# EAGLE schematic AutoPBT (EAGLE 9.7.0)
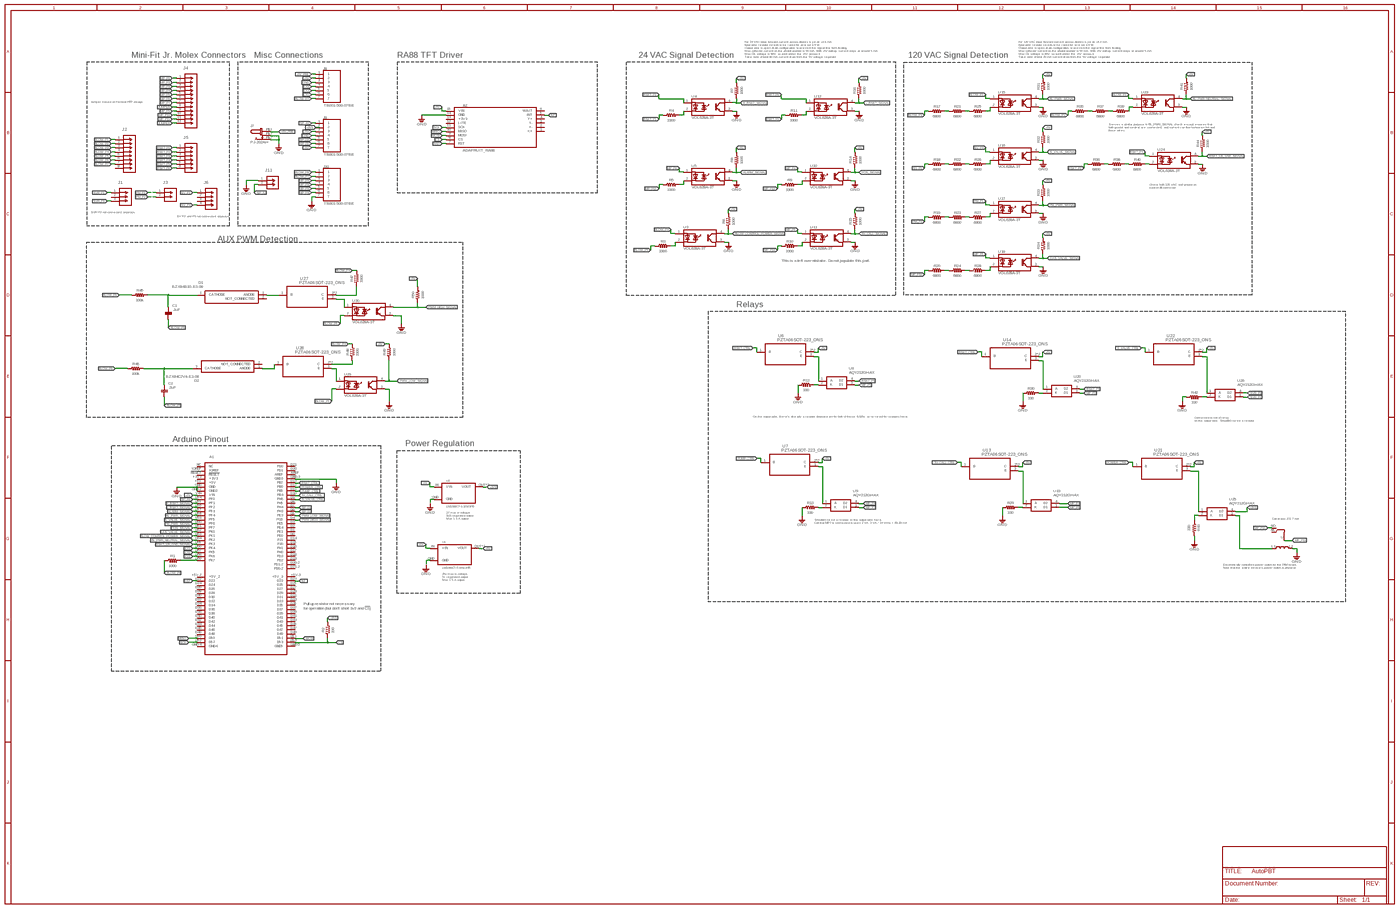
[diagram p0: schematic, sheet 1, overview]
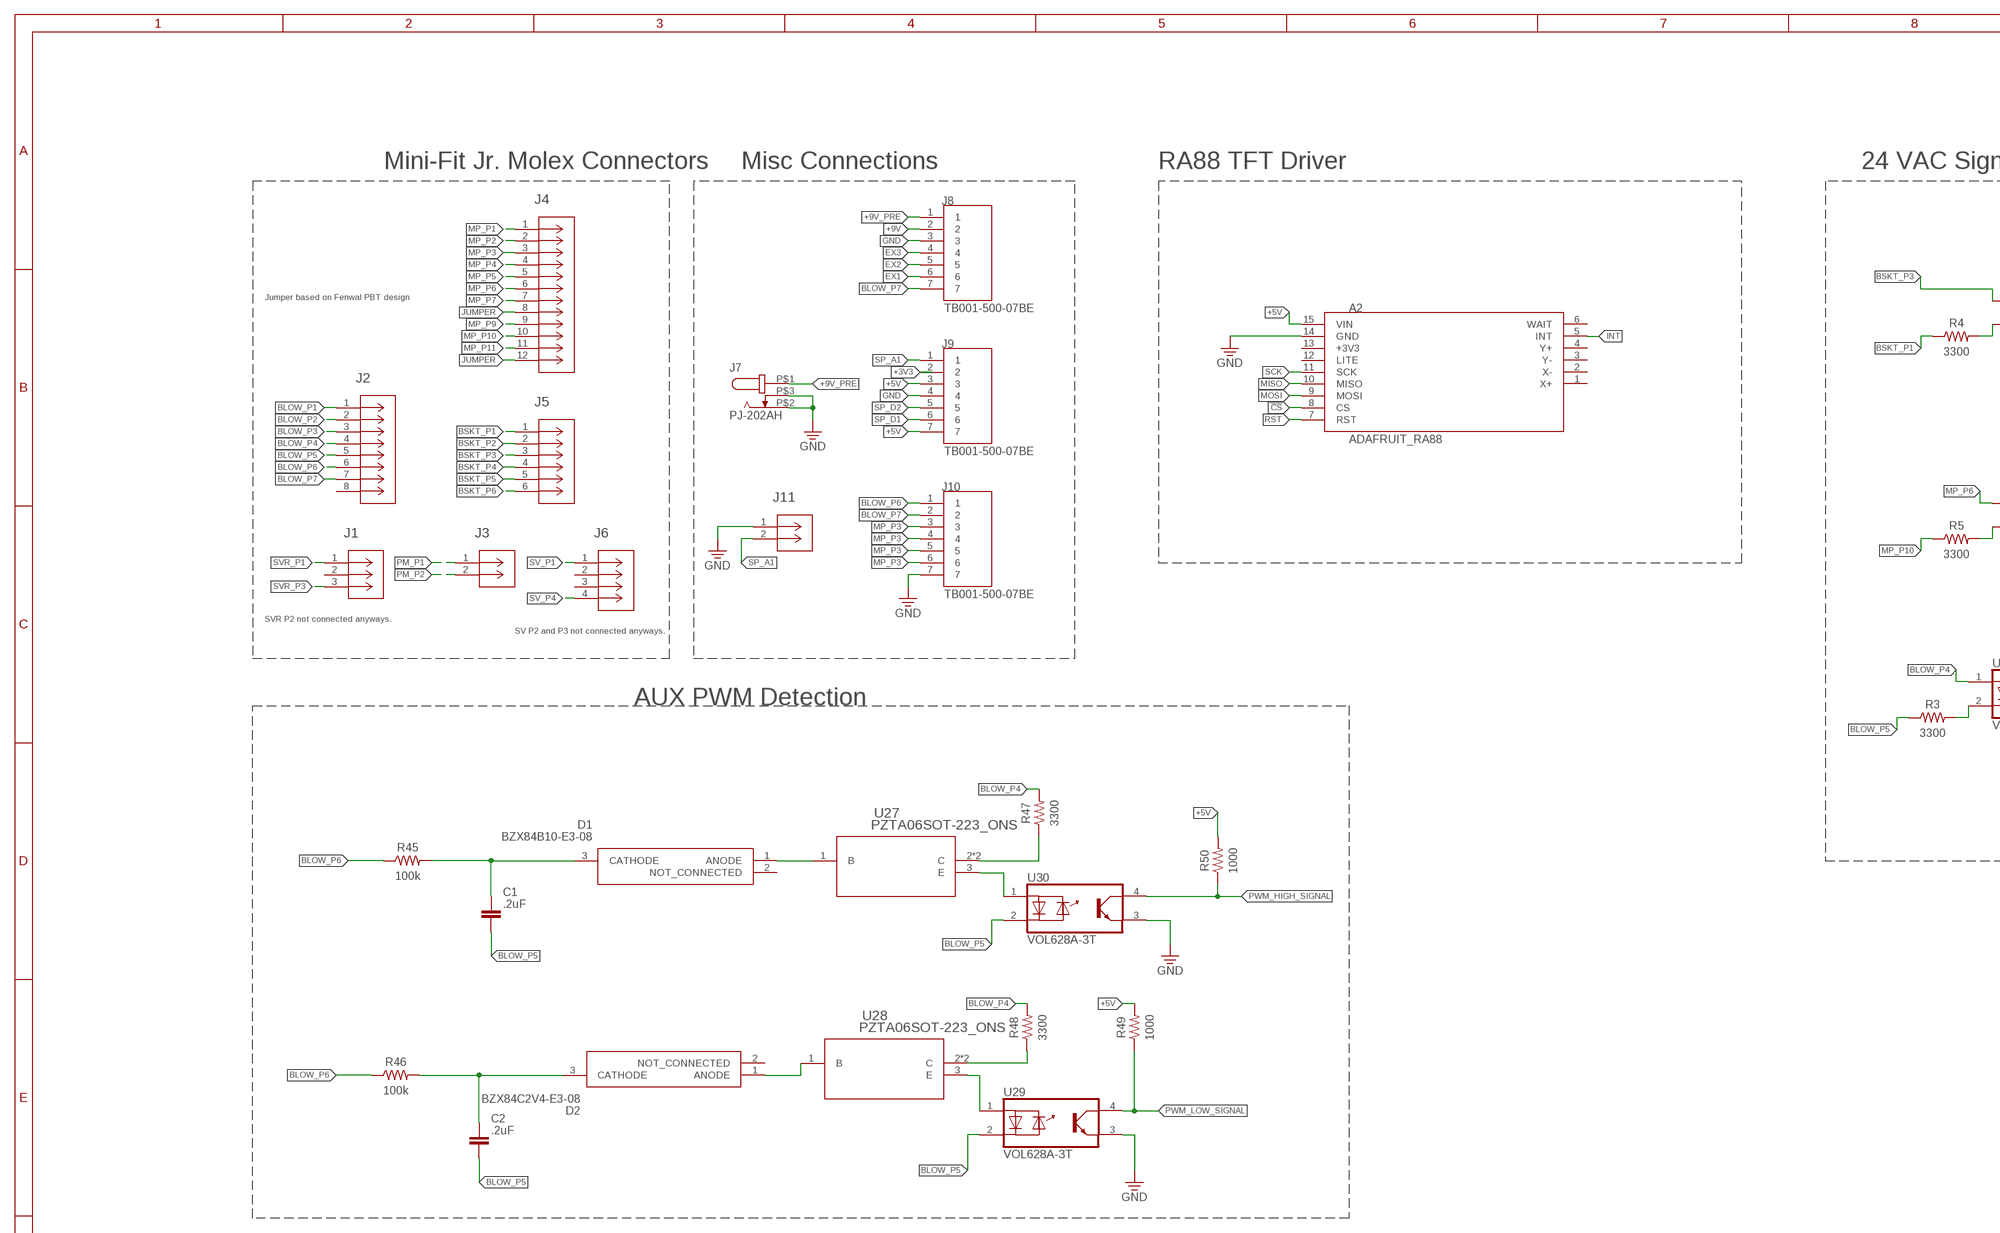
[diagram p1: schematic, sheet 1, part 1 of 4]
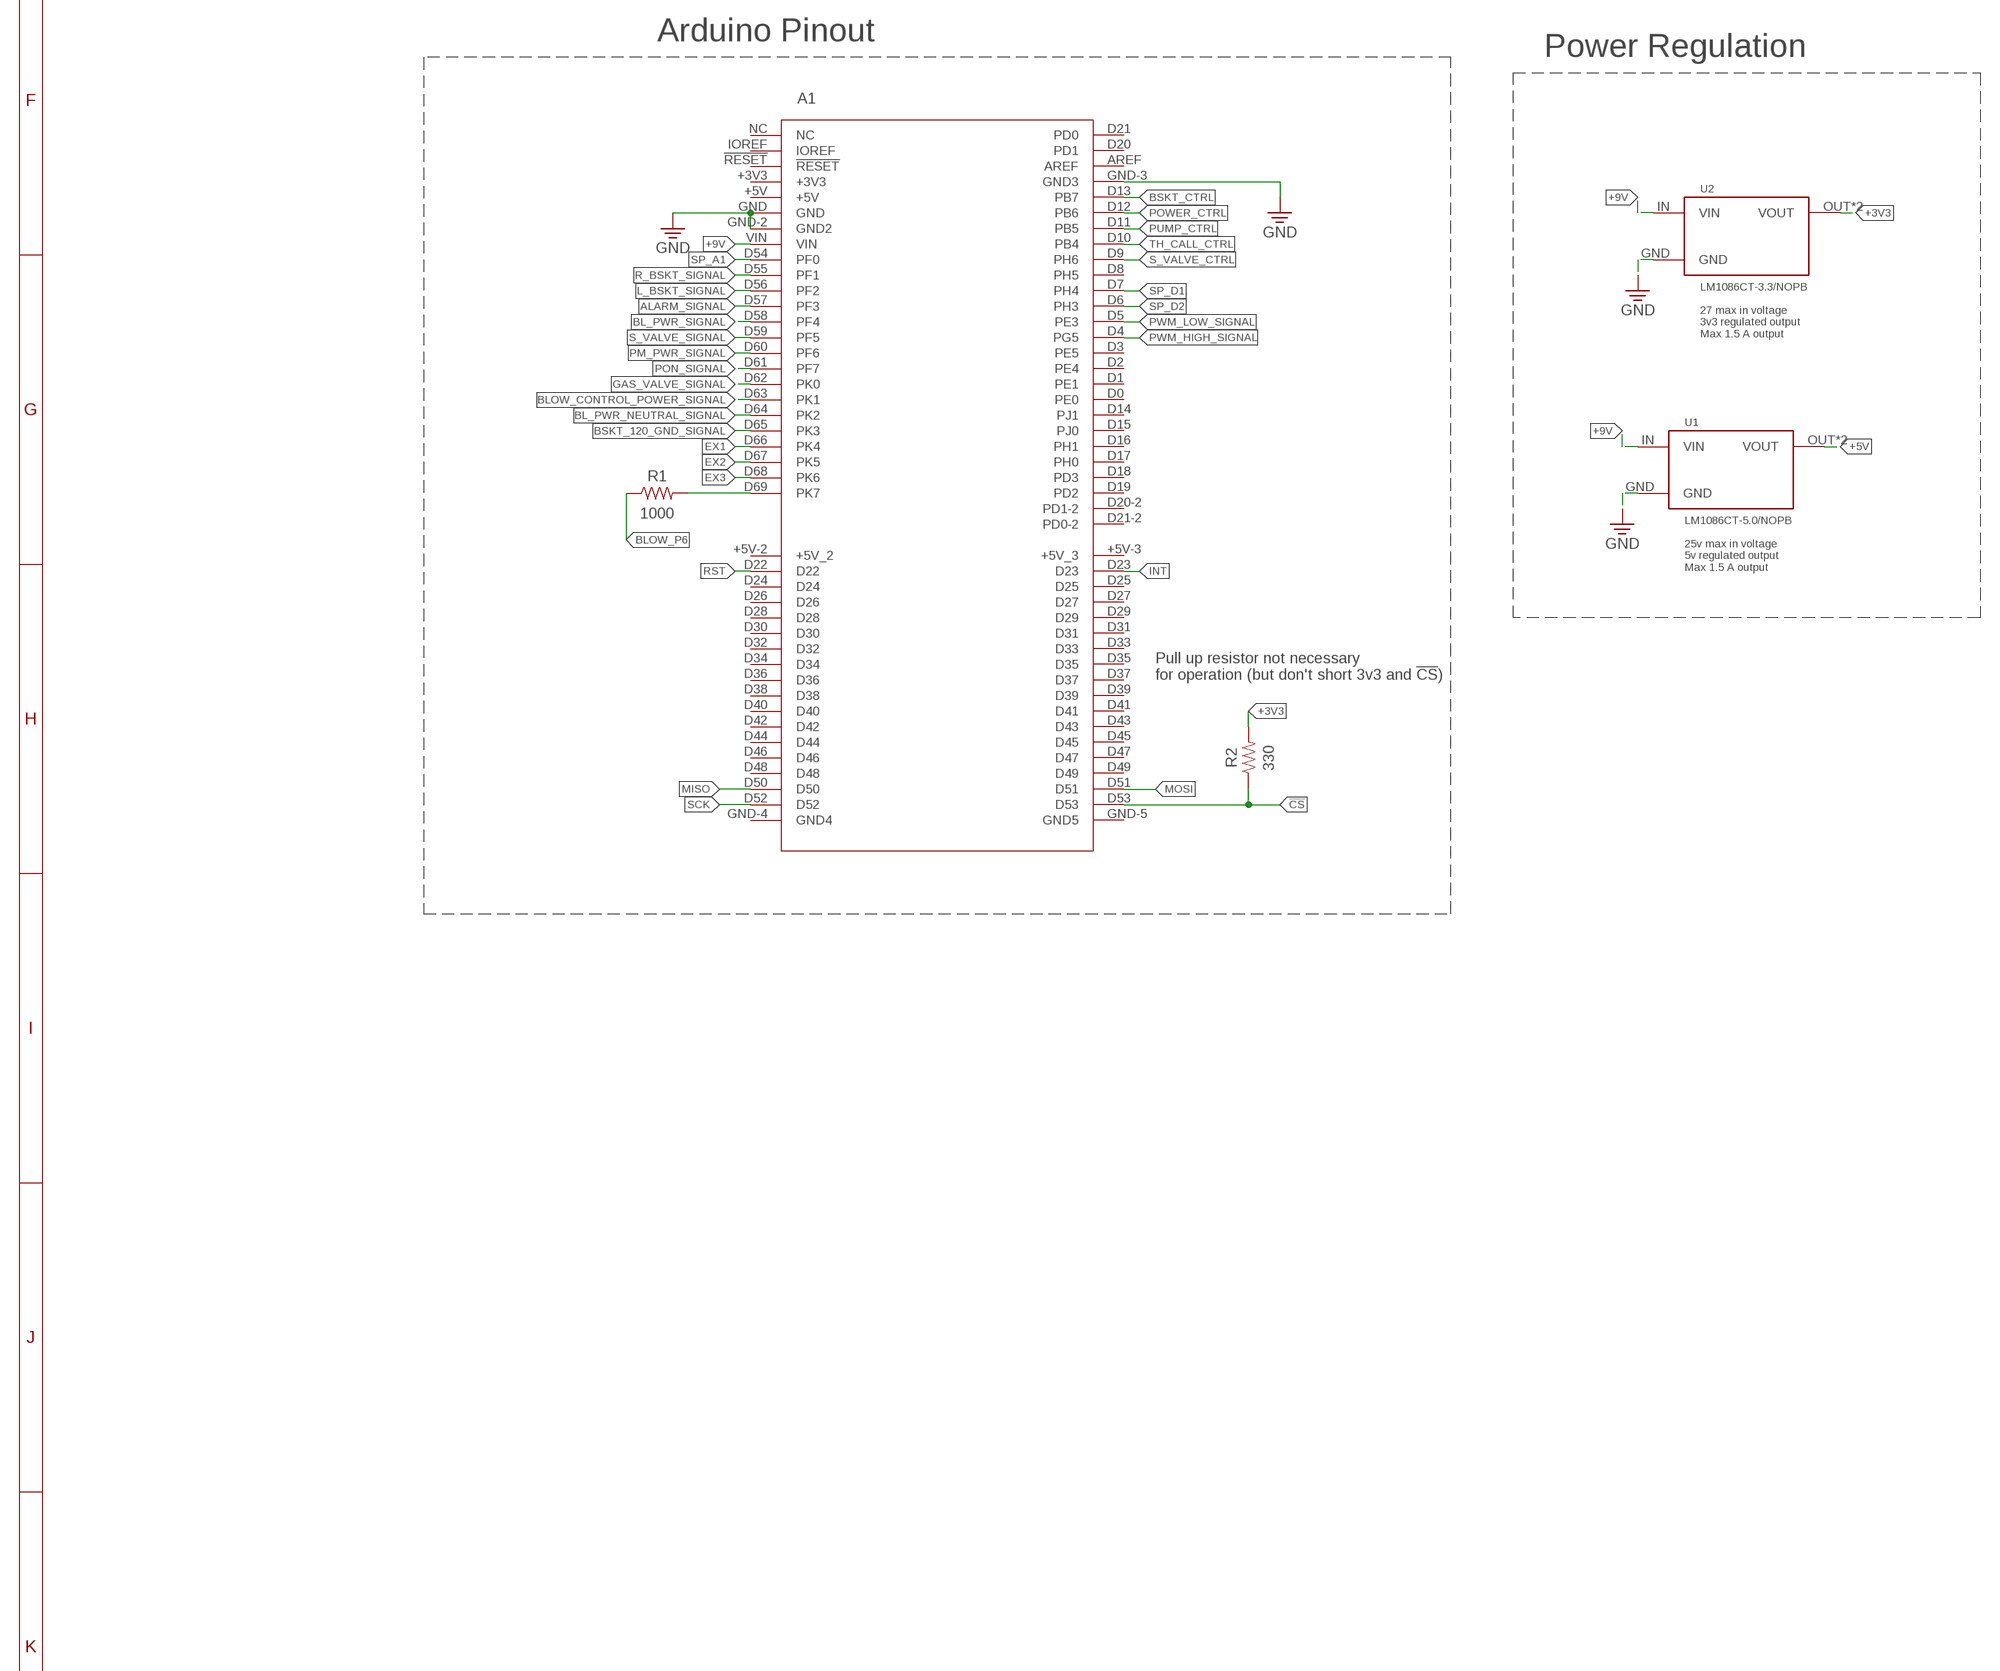
[diagram p2: schematic, sheet 1, part 2 of 4]
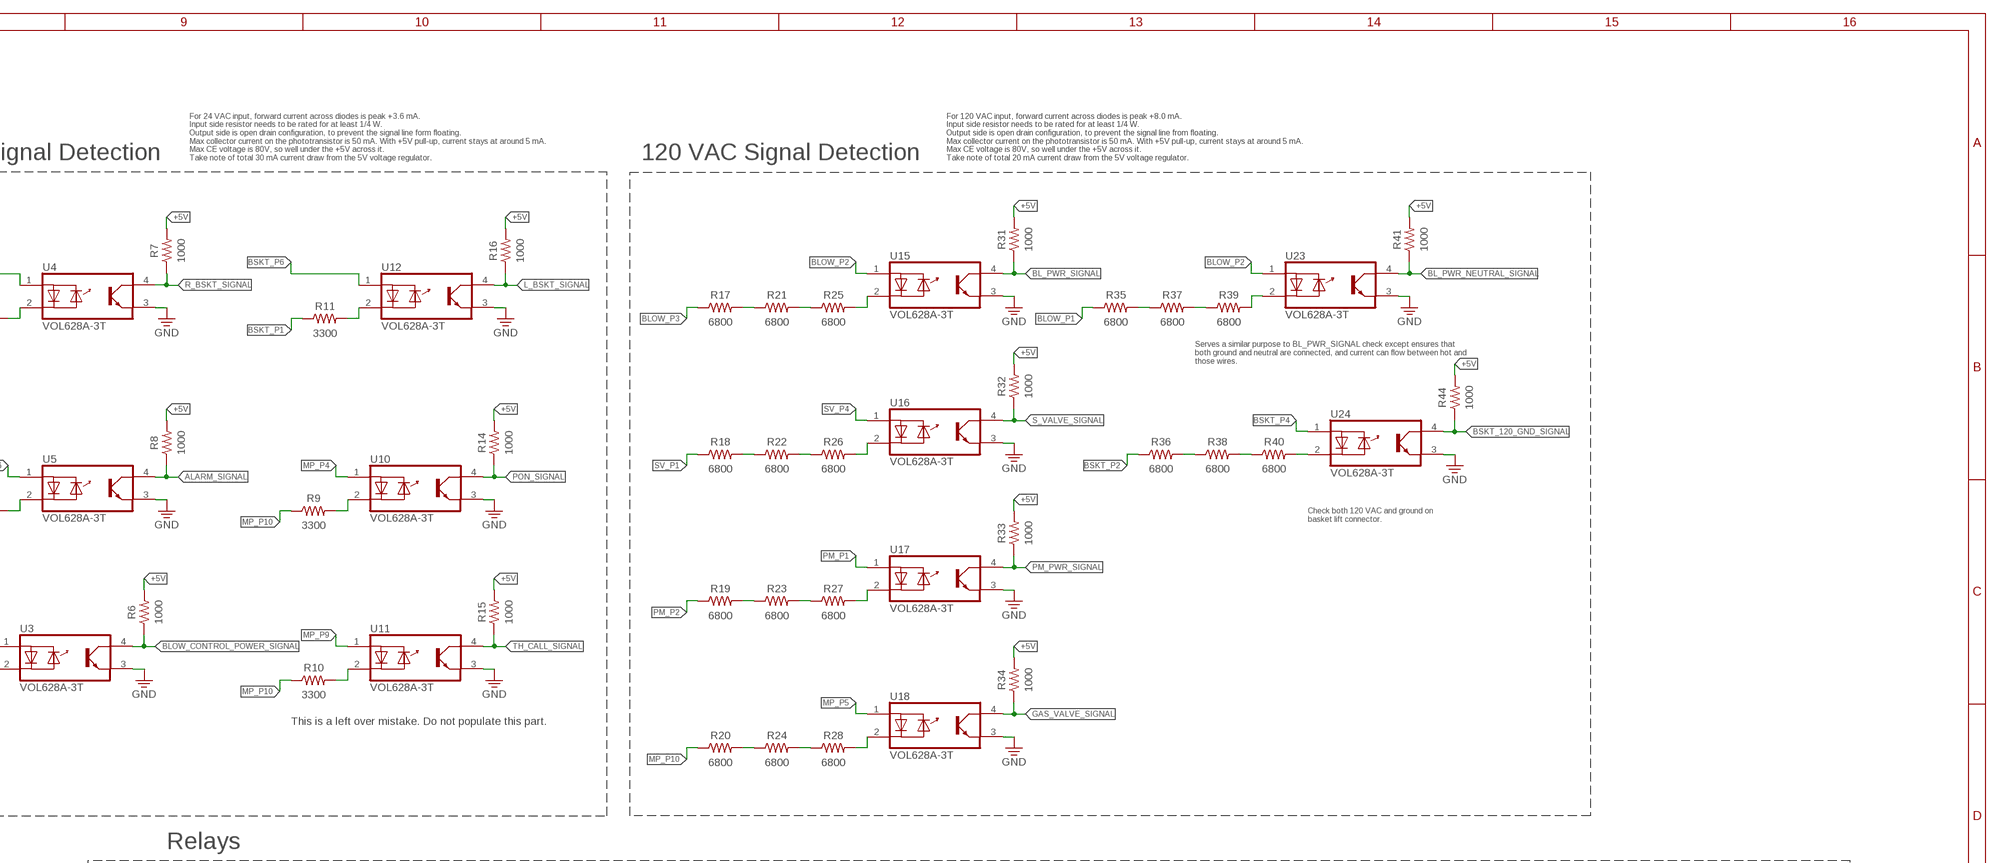
[diagram p3: schematic, sheet 1, part 3 of 4]
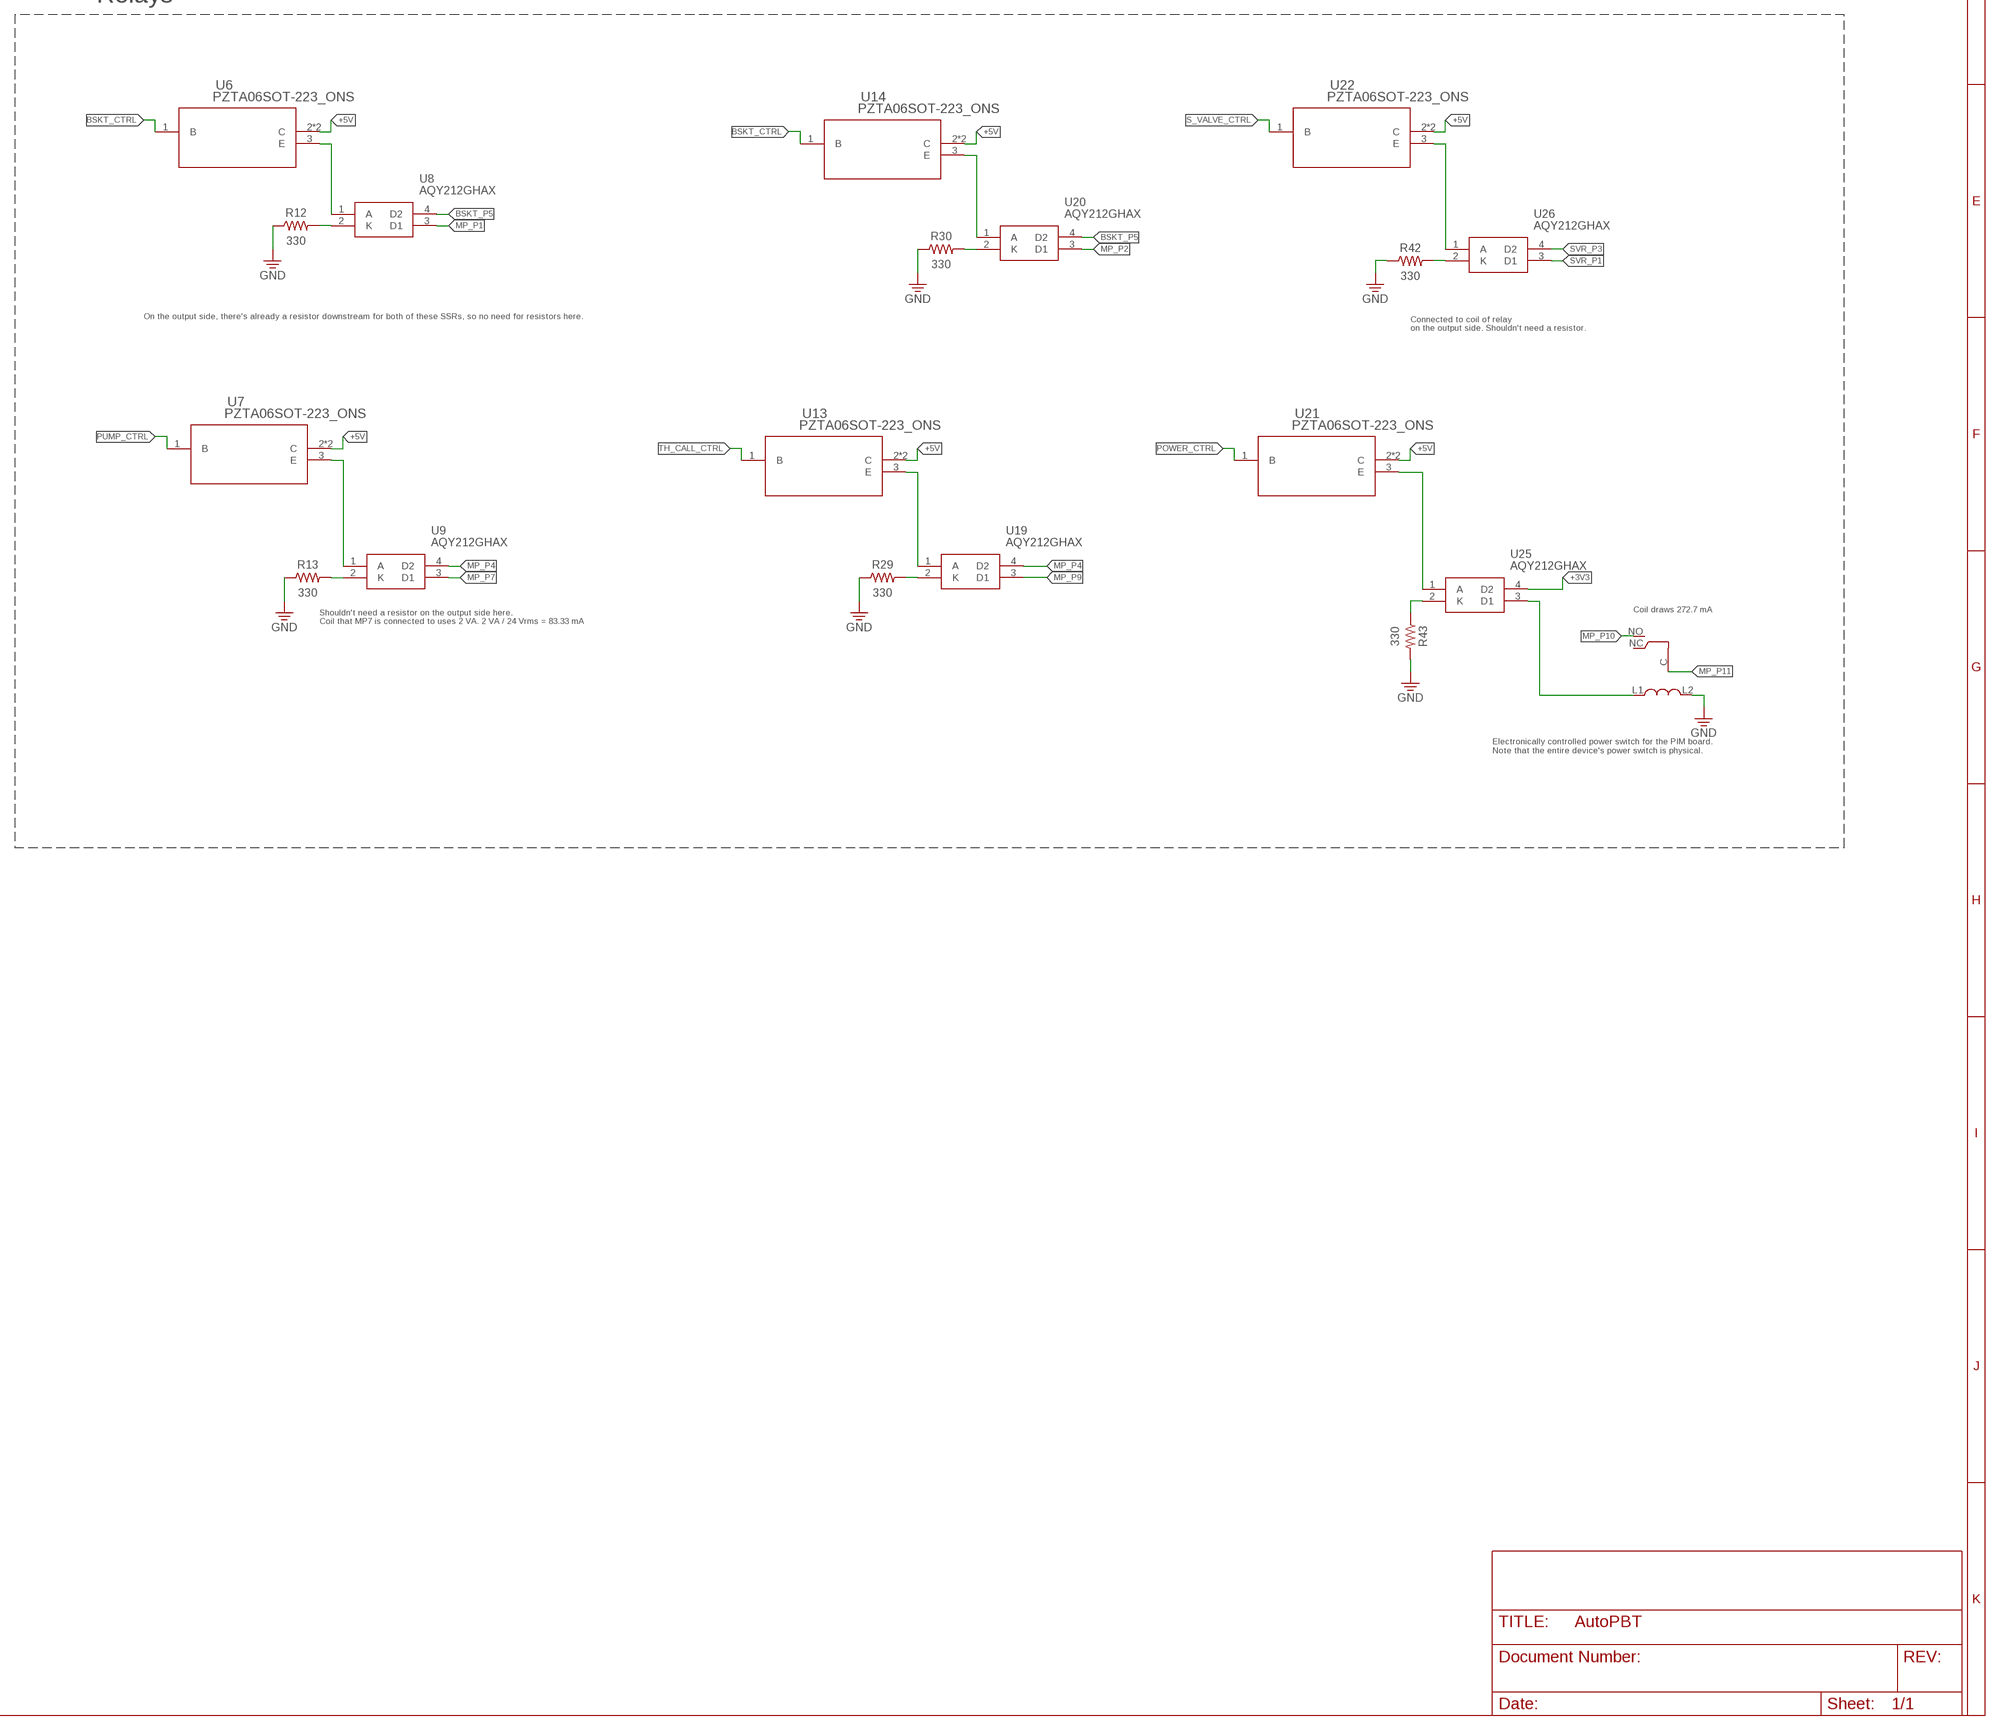
[diagram p4: schematic, sheet 1, part 4 of 4]

## Parts
A1  ARDUINO2560ARDUINO2560ACTUAL  [ARDUINO2560PINS]
A2  ADAFRUIT_RA88  [RA88]
C1  .2uF  C_CHIP-1206(3216-METRIC)  [CAPC3216X135]
C2  .2uF  C_CHIP-1206(3216-METRIC)  [CAPC3216X135]
D1  BZX84B10-E3-08  [SOT95P248X115-3N]
D2  BZX84C2V4-E3-08  [SOT95P248X115-3N]
J1  39301039CON_39301039  [CON_39301039]
J2  39281083CON_39281083  [CON_39281083]
J3  39281023CON_39281023  [CON_39281023]
J4  39281123CON_39281123  [CON_39281123]
J5  39281063CON_39281063  [CON_39281063]
J6  39299046CON_39299046  [CON_39299046]
J7  PJ-202AH  [CUI_PJ-202AH]
J8  TB001-500-07BE  [CUI_TB001-500-07BE]
J9  TB001-500-07BE  [CUI_TB001-500-07BE]
J10  TB001-500-07BE  [CUI_TB001-500-07BE]
J11  430450212CON_430450212_MOL  [CON_430450212_MOL]
K1  J107F1CS203VDC.80  [J107F1CS203VDC.80]
R1  1000  R-US_CHIP-0603(1608-METRIC)  [RESC1608X60]
R2  330  R-US_CHIP-0603(1608-METRIC)  [RESC1608X60]
R3  3300  R-US_CHIP-0603(1608-METRIC)  [RESC1608X60]
R4  3300  R-US_CHIP-0603(1608-METRIC)  [RESC1608X60]
R5  3300  R-US_CHIP-0603(1608-METRIC)  [RESC1608X60]
R6  1000  R-US_CHIP-0603(1608-METRIC)  [RESC1608X60]
R7  1000  R-US_CHIP-0603(1608-METRIC)  [RESC1608X60]
R8  1000  R-US_CHIP-0603(1608-METRIC)  [RESC1608X60]
R9  3300  R-US_CHIP-0603(1608-METRIC)  [RESC1608X60]
R10  3300  R-US_CHIP-0603(1608-METRIC)  [RESC1608X60]
R11  3300  R-US_CHIP-0603(1608-METRIC)  [RESC1608X60]
R12  330  R-US_CHIP-0603(1608-METRIC)  [RESC1608X60]
R13  330  R-US_CHIP-0603(1608-METRIC)  [RESC1608X60]
R14  1000  R-US_CHIP-0603(1608-METRIC)  [RESC1608X60]
R15  1000  R-US_CHIP-0603(1608-METRIC)  [RESC1608X60]
R16  1000  R-US_CHIP-0603(1608-METRIC)  [RESC1608X60]
R17  6800  R-US_CHIP-0603(1608-METRIC)  [RESC1608X60]
R18  6800  R-US_CHIP-0603(1608-METRIC)  [RESC1608X60]
R19  6800  R-US_CHIP-0603(1608-METRIC)  [RESC1608X60]
R20  6800  R-US_CHIP-0603(1608-METRIC)  [RESC1608X60]
R21  6800  R-US_CHIP-0603(1608-METRIC)  [RESC1608X60]
R22  6800  R-US_CHIP-0603(1608-METRIC)  [RESC1608X60]
R23  6800  R-US_CHIP-0603(1608-METRIC)  [RESC1608X60]
R24  6800  R-US_CHIP-0603(1608-METRIC)  [RESC1608X60]
R25  6800  R-US_CHIP-0603(1608-METRIC)  [RESC1608X60]
R26  6800  R-US_CHIP-0603(1608-METRIC)  [RESC1608X60]
R27  6800  R-US_CHIP-0603(1608-METRIC)  [RESC1608X60]
R28  6800  R-US_CHIP-0603(1608-METRIC)  [RESC1608X60]
R29  330  R-US_CHIP-0603(1608-METRIC)  [RESC1608X60]
R30  330  R-US_CHIP-0603(1608-METRIC)  [RESC1608X60]
R31  1000  R-US_CHIP-0603(1608-METRIC)  [RESC1608X60]
R32  1000  R-US_CHIP-0603(1608-METRIC)  [RESC1608X60]
R33  1000  R-US_CHIP-0603(1608-METRIC)  [RESC1608X60]
R34  1000  R-US_CHIP-0603(1608-METRIC)  [RESC1608X60]
R35  6800  R-US_CHIP-0603(1608-METRIC)  [RESC1608X60]
R36  6800  R-US_CHIP-0603(1608-METRIC)  [RESC1608X60]
R37  6800  R-US_CHIP-0603(1608-METRIC)  [RESC1608X60]
R38  6800  R-US_CHIP-0603(1608-METRIC)  [RESC1608X60]
R39  6800  R-US_CHIP-0603(1608-METRIC)  [RESC1608X60]
R40  6800  R-US_CHIP-0603(1608-METRIC)  [RESC1608X60]
R41  1000  R-US_CHIP-0603(1608-METRIC)  [RESC1608X60]
R42  330  R-US_CHIP-0603(1608-METRIC)  [RESC1608X60]
R43  330  R-US_CHIP-0603(1608-METRIC)  [RESC1608X60]
R44  1000  R-US_CHIP-0603(1608-METRIC)  [RESC1608X60]
R45  100k  R-US_CHIP-2512(6332-METRIC)  [RESC6332X71]
R46  100k  R-US_CHIP-2512(6332-METRIC)  [RESC6332X71]
R47  3300  R-US_CHIP-0603(1608-METRIC)  [RESC1608X60]
R48  3300  R-US_CHIP-0603(1608-METRIC)  [RESC1608X60]
R49  1000  R-US_CHIP-0603(1608-METRIC)  [RESC1608X60]
R50  1000  R-US_CHIP-0603(1608-METRIC)  [RESC1608X60]
U1  LM1086CT-5.0/NOPB  [LM1086CT-3.3/NOPB]
U2  LM1086CT-3.3/NOPB  [LM1086CT-3.3/NOPB]
U3  VOL628A-3T  [SOIC254P1020X230-4N]
U4  VOL628A-3T  [SOIC254P1020X230-4N]
U5  VOL628A-3T  [SOIC254P1020X230-4N]
U6  PZTA06SOT-223_ONS  [SOT-223_ONS]
U7  PZTA06SOT-223_ONS  [SOT-223_ONS]
U8  AQY212GHAX  [SOP254P962X315-4N]
U9  AQY212GHAX  [SOP254P962X315-4N]
U10  VOL628A-3T  [SOIC254P1020X230-4N]
U11  VOL628A-3T  [SOIC254P1020X230-4N]
U12  VOL628A-3T  [SOIC254P1020X230-4N]
U13  PZTA06SOT-223_ONS  [SOT-223_ONS]
U14  PZTA06SOT-223_ONS  [SOT-223_ONS]
U15  VOL628A-3T  [SOIC254P1020X230-4N]
U16  VOL628A-3T  [SOIC254P1020X230-4N]
U17  VOL628A-3T  [SOIC254P1020X230-4N]
U18  VOL628A-3T  [SOIC254P1020X230-4N]
U19  AQY212GHAX  [SOP254P962X315-4N]
U20  AQY212GHAX  [SOP254P962X315-4N]
U21  PZTA06SOT-223_ONS  [SOT-223_ONS]
U22  PZTA06SOT-223_ONS  [SOT-223_ONS]
U23  VOL628A-3T  [SOIC254P1020X230-4N]
U24  VOL628A-3T  [SOIC254P1020X230-4N]
U25  AQY212GHAX  [SOP254P962X315-4N]
U26  AQY212GHAX  [SOP254P962X315-4N]
U27  PZTA06SOT-223_ONS  [SOT-223_ONS]
U28  PZTA06SOT-223_ONS  [SOT-223_ONS]
U29  VOL628A-3T  [SOIC254P1020X230-4N]
U30  VOL628A-3T  [SOIC254P1020X230-4N]

## Nets
!CS! [SPI]: A1.D53 A2.8(CS) R2.1
+3V3: J9.2 R2.2 U2.OUT2(VOUT) U2.OUT(VOUT) U25.4(D2)
+5V: A2.15(VIN) J9.3 J9.7 R6.2 R7.2 R8.2 R14.2 R15.2 R16.2 R31.2 R32.2 R33.2 R34.2 R41.2 R44.2 R49.2 R50.2 U1.OUT2(VOUT) U1.OUT(VOUT) U6.2(C) U6.4(C) U7.2(C) U7.4(C) U13.2(C) U13.4(C) U14.2(C) U14.4(C) U21.2(C) U21.4(C) U22.2(C) U22.4(C)
+9V: A1.VIN J8.2 U1.IN(VIN) U2.IN(VIN)
+9V_PRE: J7.P$1 J8.1
ALARM_SIGNAL: A1.D57(PF3) R8.1 U5.4(CO)
BL_PWR_NEUTRAL_SIGNAL: A1.D64(PK2) R41.1 U23.4(CO)
BL_PWR_SIGNAL: A1.D58(PF4) R31.1 U15.4(CO)
BLOW_CONTROL_POWER_SIGNAL: A1.D63(PK1) R6.1 U3.4(CO)
BLOW_P1: J2.1 R35.1
BLOW_P2: J2.2 U15.1(A/C) U23.1(A/C)
BLOW_P3: J2.3 R17.1
BLOW_P4: J2.4 R47.2 R48.2 U3.1(A/C)
BLOW_P5: C1.2 C2.2 J2.5 R3.1 U29.2(C/A) U30.2(C/A)
BLOW_P6: J2.6 J10.1 R1.1 R45.1 R46.1
BLOW_P7: J2.7 J8.7 J10.2
BSKT_120_GND_SIGNAL: A1.D65(PK3) R44.1 U24.4(CO)
BSKT_CTRL: A1.D13(PB7) U6.1(B) U14.1(B)
BSKT_P1: J5.1 R4.1 R11.1
BSKT_P2: J5.2 R36.1
BSKT_P3: J5.3 U4.1(A/C)
BSKT_P4: J5.4 U24.1(A/C)
BSKT_P5: J5.5 U8.4(D2) U20.4(D2)
BSKT_P6: J5.6 U12.1(A/C)
EX1: A1.D66(PK4) J8.6
EX2: A1.D67(PK5) J8.5
EX3: A1.D68(PK6) J8.4
GAS_VALVE_SIGNAL: A1.D62(PK0) R34.1 U18.4(CO)
GND: A1.GND A1.GND-2(GND2) A1.GND-3(GND3) A2.14(GND) J7.P$2 J7.P$3 J8.3 J9.4 J10.7 J11.1 K1.L2 R12.1 R13.1 R29.1 R30.1 R42.1 R43.2 U1.GND U2.GND U3.3(E) U4.3(E) U5.3(E) U10.3(E) U11.3(E) U12.3(E) U15.3(E) U16.3(E) U17.3(E) U18.3(E) U23.3(E) U24.3(E) U29.3(E) U30.3(E)
INT: A1.D23 A2.5(INT)
JUMPER: J4.8 J4.12
L_BSKT_SIGNAL: A1.D56(PF2) R16.1 U12.4(CO)
MISO [SPI]: A1.D50 A2.10(MISO)
MOSI [SPI]: A1.D51 A2.9(MOSI)
MP_P1: J4.1 U8.3(D1)
MP_P2: J4.2 U20.3(D1)
MP_P3: J4.3 J10.3 J10.4 J10.5 J10.6
MP_P4: J4.4 U9.4(D2) U10.1(A/C) U19.4(D2)
MP_P5: J4.5 U18.1(A/C)
MP_P6: J4.6 U5.1(A/C)
MP_P7: J4.7 U9.3(D1)
MP_P9: J4.9 U11.1(A/C) U19.3(D1)
MP_P10: J4.10 K1.NO R5.1 R9.1 R10.1 R20.1
MP_P11: J4.11 K1.C
N$1: R30.2 U20.2(K)
N$2: R29.2 U19.2(K)
N$3: R13.2 U9.2(K)
N$4: U6.3(E) U8.1(A)
N$5: R42.2 U26.2(K)
N$6: R43.1 U25.2(K)
N$8: U14.3(E) U20.1(A)
N$9: R39.2 U23.2(C/A)
N$10: R37.2 R39.1
N$11: R35.2 R37.1
N$12: R40.2 U24.2(C/A)
N$13: R38.2 R40.1
N$14: R36.2 R38.1
N$15: U22.3(E) U26.1(A)
N$16: U7.3(E) U9.1(A)
N$17: R9.2 U10.2(C/A)
N$18: U13.3(E) U19.1(A)
N$19: U21.3(E) U25.1(A)
N$20: R11.2 U12.2(C/A)
N$21: C2.1 D2.3(CATHODE) R46.2
N$22: R3.2 U3.2(C/A)
N$23: R4.2 U4.2(C/A)
N$24: D2.1(ANODE) U28.1(B)
N$25: R10.2 U11.2(C/A)
N$26: R5.2 U5.2(C/A)
N$27: A1.D69(PK7) R1.2
N$28: R25.2 U15.2(C/A)
N$29: R21.2 R25.1
N$30: R17.2 R21.1
N$31: R26.2 U16.2(C/A)
N$32: R22.2 R26.1
N$33: R18.2 R22.1
N$34: R27.2 U17.2(C/A)
N$35: R23.2 R27.1
N$36: R19.2 R23.1
N$37: R28.2 U18.2(C/A)
N$38: R24.2 R28.1
N$39: R20.2 R24.1
N$40: R12.2 U8.2(K)
N$41: D1.1(ANODE) U27.1(B)
N$42: C1.1 D1.3(CATHODE) R45.2
N$44: U28.3(E) U29.1(A/C)
N$45: U27.3(E) U30.1(A/C)
N$48: R47.1 U27.2(C) U27.4(C)
N$49: R48.1 U28.2(C) U28.4(C)
PM_P1: J3.1 U17.1(A/C)
PM_P2: J3.2 R19.1
PM_PWR_SIGNAL: A1.D60(PF6) R33.1 U17.4(CO)
PON_SIGNAL: A1.D61(PF7) R14.1 U10.4(CO)
POWER_CTRL: A1.D12(PB6) U21.1(B)
PUMP_CTRL: A1.D11(PB5) U7.1(B)
PWM_HIGH_SIGNAL: A1.D4(PG5) R50.1 U30.4(CO)
PWM_LOW_SIGNAL: A1.D5(PE3) R49.1 U29.4(CO)
R_BSKT_SIGNAL: A1.D55(PF1) R7.1 U4.4(CO)
RELAY_POW: K1.L1 U25.3(D1)
RST: A1.D22 A2.7(RST)
S_VALVE_CTRL: A1.D9(PH6) U22.1(B)
S_VALVE_SIGNAL: A1.D59(PF5) R32.1 U16.4(CO)
SCK [SPI]: A1.D52 A2.11(SCK)
SP_A1: A1.D54(PF0) J9.1 J11.2
SP_D1: A1.D7(PH4) J9.6
SP_D2: A1.D6(PH3) J9.5
SV_P1: J6.1 R18.1
SV_P4: J6.4 U16.1(A/C)
SVR_P1: J1.1 U26.3(D1)
SVR_P3: J1.3 U26.4(D2)
TH_CALL_CTRL: A1.D10(PB4) U13.1(B)
TH_CALL_SIGNAL: R15.1 U11.4(CO)
Unconnected: A1.!RESET! A1.+3V3 A1.+5V A1.+5V-2(+5V_2) A1.+5V-3(+5V_3) A1.AREF A1.D0(PE0) A1.D1(PE1) A1.D2(PE4) A1.D3(PE5) A1.D8(PH5) A1.D14(PJ1) A1.D15(PJ0) A1.D16(PH1) A1.D17(PH0) A1.D18(PD3) A1.D19(PD2) A1.D20(PD1) A1.D20-2(PD1-2) A1.D21(PD0) A1.D21-2(PD0-2) A1.D24 A1.D25 A1.D26 A1.D27 A1.D28 A1.D29 A1.D30 A1.D31 A1.D32 A1.D33 A1.D34 A1.D35 A1.D36 A1.D37 A1.D38 A1.D39 A1.D40 A1.D41 A1.D42 A1.D43 A1.D44 A1.D45 A1.D46 A1.D47 A1.D48 A1.D49 A1.GND-4(GND4) A1.GND-5(GND5) A1.IOREF A1.NC A2.1(X+) A2.2(X-) A2.3(Y-) A2.4(Y+) A2.6(WAIT) A2.12(LITE) A2.13(+3V3) D1.2(NOT_CONNECTED) D2.2(NOT_CONNECTED) J1.2 J2.8 J6.2 J6.3 K1.NC

## Notes on the sheet
- Mini-Fit Jr. Molex Connectors | Misc Connections | RA88 TFT Driver | 24 VAC Signal Detection
- For 24 VAC input, forward current across diodes is peak +3.6 mA.
  Input side resistor needs to be rated for at least 1/4 W.
  Output side is open drain configuration, to prevent the signal line form floating. 
  Max collector current on the phototransistor is 50 mA. With +5V pull-up, current stays at around 5 mA. 
  Max CE voltage is 80V, so well under the +5V across it.
  Take note of total 30 mA current draw from the 5V voltage regulator.
- 120 VAC Signal Detection
- For 120 VAC input, forward current across diodes is peak +8.0 mA.
  Input side resistor needs to be rated for at least 1/4 W.
  Output side is open drain configuration, to prevent the signal line from floating. 
  Max collector current on the phototransistor is 50 mA. With +5V pull-up, current stays at around 5 mA. 
  Max CE voltage is 80V, so well under the +5V across it.
  Take note of total 20 mA current draw from the 5V voltage regulator.
- Jumper based on Fenwal PBT design
- Serves a similar purpose to BL_PWR_SIGNAL check except ensures that 
  both ground and neutral are connected, and current can flow between hot and 
  those wires.
- Check both 120 VAC and ground on
  basket lift connector.
- SVR P2 not connected anyways.
- SV P2 and P3 not connected anyways.
- AUX PWM Detection
- This is a left over mistake. Do not populate this part.
- Relays
- On the output side, there's already a resistor downstream for both of these SSRs, so no need for resistors here.
- Connected to coil of relay
  on the output side. Shouldn't need a resistor.
- Arduino Pinout
- Power Regulation
- 27 max in voltage
  3v3 regulated output
  Max 1.5 A output
- Coil draws 272.7 mA
- Shouldn't need a resistor on the output side here. 
  Coil that MP7 is connected to uses 2 VA. 2 VA / 24 Vrms = 83.33 mA
- Electronically controlled power switch for the PIM board. 
  Note that the entire device's power switch is physical.
- 25v max in voltage
  5v regulated output
  Max 1.5 A output
- Pull up resistor not necessary 
  for operation (but don't short 3v3 and !CS!)

## Library data of the parts
A1 = ADVANCEDPBTLIB:ARDUINO2560
A2 = ADVANCEDPBTLIB:ADAFRUIT_RA88
C1 C2 = Capacitor:C: Capacitor - Generic; CATEGORY: Capacitor
D1 = ADVANCEDPBTLIB:BZX84B10-E3-08
D2 = ADVANCEDPBTLIB:BZX84C2V4-E3-08: Zener Diodes 2.4 Volt 0.35W 5% Source: Datasheet <https://componentsearchengine.com/Datasheets/1/BZX84C2V4-E3-08.pdf>; ARROW_PART_NUMBER: BZX84C2V4-E3-08; ARROW_PRICE-STOCK: https://www.arrow.com/en/products/bzx84c2v4-e3-08/vishay; DESCRIPTION: Zener Diodes 2.4 Volt 0.35W 5%; HEIGHT: 1.15mm; MANUFACTURER_NAME: Vishay; MANUFACTURER_PART_NUMBER: BZX84C2V4-E3-08; MOUSER_PART_NUMBER: 78-BZX84C2V4-E3-08; MOUSER_PRICE-STOCK: https://www.mouser.co.uk/ProductDetail/Vishay-Semiconductors/BZX84C2V4-E3-08?qs=KP8Io%2FXyE5Sb0eHjk15Scw%3D%3D
J1 = ADVANCEDPBTLIB:39301039; COPYRIGHT: Copyright (C) 2022 Ultra Librarian. All rights reserved.; MANUFACTURER_PART_NUMBER: 39301039; MFR_NAME: Molex Connector Corporation
J2 = ADVANCEDPBTLIB:39281083; COPYRIGHT: Copyright (C) 2022 Ultra Librarian. All rights reserved.; MANUFACTURER_PART_NUMBER: 39281083; MFR_NAME: Molex Connector Corporation
J3 = ADVANCEDPBTLIB:39281023; COPYRIGHT: Copyright (C) 2022 Ultra Librarian. All rights reserved.; MANUFACTURER_PART_NUMBER: 39281023; MFR_NAME: Molex Connector Corporation
J4 = ADVANCEDPBTLIB:39281123; COPYRIGHT: Copyright (C) 2022 Ultra Librarian. All rights reserved.; MANUFACTURER_PART_NUMBER: 39281123; MFR_NAME: Molex Connector Corporation
J5 = ADVANCEDPBTLIB:39281063; COPYRIGHT: Copyright (C) 2022 Ultra Librarian. All rights reserved.; MANUFACTURER_PART_NUMBER: 39281063; MFR_NAME: Molex Connector Corporation
J6 = ADVANCEDPBTLIB:39299046; COPYRIGHT: Copyright (C) 2022 Ultra Librarian. All rights reserved.; MANUFACTURER_PART_NUMBER: 39299046; MFR_NAME: Molex Connector Corporation
J7 = ADVANCEDPBTLIB:PJ-202AH: 2.0 mm Center Pin, 5.0 A, Right Angle, Through Hole, Kinked Pins, Dc Power Jack Connector; MANUFACTURER: CUI INC; PART_REV: 1.02; STANDARD: Manufacturer recommendations
J8-J10 = ADVANCEDPBTLIB:TB001-500-07BE; MANUFACTURER: CUI; STANDARD: Manufacturer Recommendations
J11 = ADVANCEDPBTLIB:430450212; COPYRIGHT: Copyright (C) 2022 Ultra Librarian. All rights reserved.; MANUFACTURER_PART_NUMBER: 430450212; MFR_NAME: Molex Connector Corporation
K1 = ADVANCEDPBTLIB:J107F1CS203VDC.80
R1-R50 = Resistor:R-US: Resistor Fixed - ANSI; CATEGORY: Resistor; SUB-CATEGORY: Fixed
U1 = ADVANCEDPBTLIB:LM1086CT-5.0/NOPB
U2 = ADVANCEDPBTLIB:LM1086CT-3.3/NOPB
U3-U5 U10-U12 U15-U18 U23 U24 U29 U30 = ADVANCEDPBTLIB:VOL628A-3T: Optocoupler, Phototransistor Output, AC Input, Low Input Current, 4 Pin LSOP, Long Creepage Mini-Flat Package; MANUFACTURER: VISHAY
U6 U7 U13 U14 U21 U22 U27 U28 = ADVANCEDPBTLIB:PZTA06; COPYRIGHT: Copyright (C) 2022 Ultra Librarian. All rights reserved.; DIGI-KEY_PART_NUMBER_1: PZTA06TR-ND; DIGI-KEY_PART_NUMBER_2: PZTA06CT-ND; DIGI-KEY_PART_NUMBER_3: PZTA06DKR-ND; MANUFACTURER_PART_NUMBER: PZTA06; MFR_NAME: onsemi
U8 U9 U19 U20 U25 U26 = ADVANCEDPBTLIB:AQY212GHAX: PANASONIC - AQY212GHAX - MOSFET Relay, SPST-NO, 1.1 A, Gull Wing, 60 V, 0.7 ohm, 5 kV Source: Datasheet <https://www.digikey.in/product-detail/en/panasonic-electric-works/AQY212GHAX/255-6063-1-ND/8549338>; ARROW_PART_NUMBER: AQY212GHAX; ARROW_PRICE-STOCK: https://www.arrow.com/en/products/aqy212ghax/panasonic?region=europe; DESCRIPTION: PANASONIC - AQY212GHAX - MOSFET Relay, SPST-NO, 1.1 A, Gull Wing, 60 V, 0.7 ohm, 5 kV; HEIGHT: 3.15mm; MANUFACTURER_NAME: Panasonic; MANUFACTURER_PART_NUMBER: AQY212GHAX; MOUSER_PART_NUMBER: 667-AQY212GHAX; MOUSER_PRICE-STOCK: https://www.mouser.co.uk/ProductDetail/Panasonic-Industrial-Devices/AQY212GHAX?qs=wKtUvITRiamLwz7hthc4Hg%3D%3D